# EAGLE schematic 11_16 Inverter PCB Schematic (EAGLE 7.7.0)
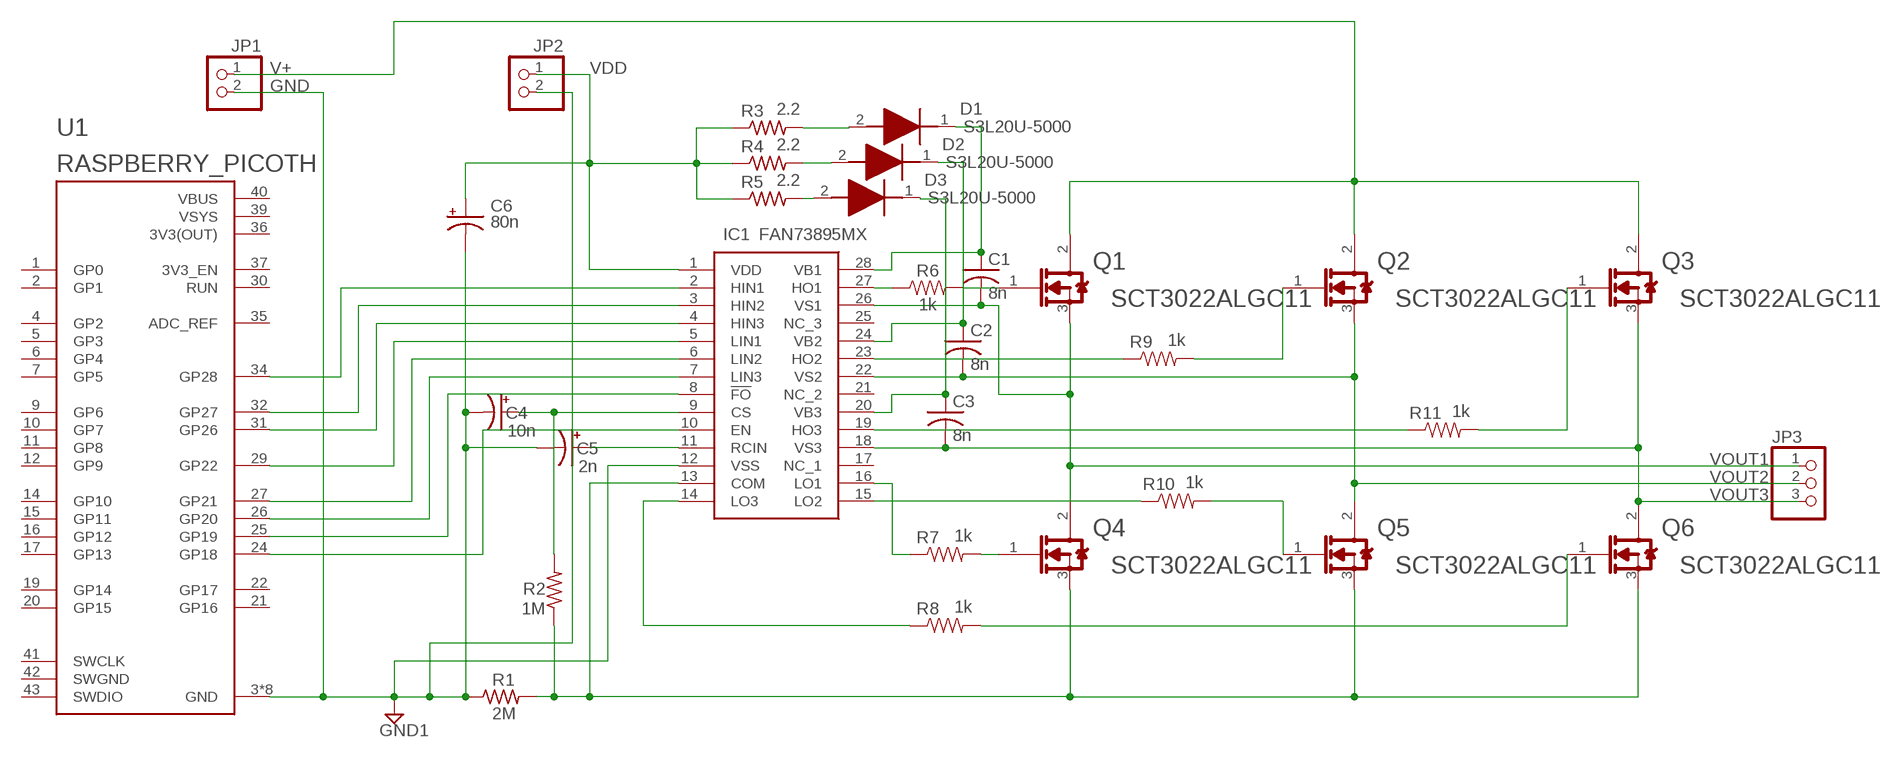
[diagram p0: schematic, sheet 1]

## Parts
C1  8n  C-US025-024X044  [C025-024X044]
C2  8n  C-US025-024X044  [C025-024X044]
C3  8n  C-US025-024X044  [C025-024X044]
C4  10n  CPOL-USSMCZ  [SMC_Z]
C5  2n  CPOL-USSMCZ  [SMC_Z]
C6  80n  CPOL-USSMCZ  [SMC_Z]
D1  S3L20U-5000  [DIOAD2460W140L700D440]
D2  S3L20U-5000  [DIOAD2460W140L700D440]
D3  S3L20U-5000  [DIOAD2460W140L700D440]
IC1  FAN73895MX  [SOIC127P1031X265-28N]
JP1  PINHD-1X2  [1X02]
JP2  PINHD-1X2  [1X02]
JP3  PINHD-1X3  [1X03]
Q1  ROHM_SCT3022ALGC11ROHM_SCT3022ALGC11_0_0  [ROHM_SCT3022ALGC11_0]
Q2  ROHM_SCT3022ALGC11ROHM_SCT3022ALGC11_0_0  [ROHM_SCT3022ALGC11_0]
Q3  ROHM_SCT3022ALGC11ROHM_SCT3022ALGC11_0_0  [ROHM_SCT3022ALGC11_0]
Q4  ROHM_SCT3022ALGC11ROHM_SCT3022ALGC11_0_0  [ROHM_SCT3022ALGC11_0]
Q5  ROHM_SCT3022ALGC11ROHM_SCT3022ALGC11_0_0  [ROHM_SCT3022ALGC11_0]
Q6  ROHM_SCT3022ALGC11ROHM_SCT3022ALGC11_0_0  [ROHM_SCT3022ALGC11_0]
R1  2M  R-US_0207/10  [0207/10]
R2  1M  R-US_0207/10  [0207/10]
R3  2.2  R-US_0207/10  [0207/10]
R4  2.2  R-US_0207/10  [0207/10]
R5  2.2  R-US_0207/10  [0207/10]
R6  1k  RESISTOR0603  [0603]
R7  1k  RESISTOR0603  [0603]
R8  1k  RESISTOR0603  [0603]
R9  1k  RESISTOR0603  [0603]
R10  1k  RESISTOR0603  [0603]
R11  1k  RESISTOR0603  [0603]
U1  RASPBERRY_PICOTH  [PICO-PKG-TH]

## Nets
GND: C4.- C5.- C6.- IC1.12(VSS) JP1.2 JP2.2 R1.1 U1.3(GND) U1.8(GND) U1.13(GND) U1.18(GND) U1.23(GND) U1.28(GND) U1.33(GND) U1.38(GND) ; supply symbol labelled GND1
N$1: IC1.2(HIN1) U1.34(GP28)
N$2: IC1.13(COM) Q4.3(SOURCE) Q5.3(SOURCE) Q6.3(SOURCE) R1.2 R2.1
N$3: IC1.19(HO3) R11.1
N$4: IC1.27(HO1) R6.1
N$5: IC1.8(!FO) U1.25(GP19)
N$6: Q1.1(GATE) R6.2
N$7: IC1.16(LO1) R7.1
N$8: Q5.1(GATE) R10.2
N$9: IC1.14(LO3) R8.1
N$10: Q3.1(GATE) R11.2
N$11: Q2.1(GATE) R9.2
N$12: IC1.10(EN) U1.24(GP18)
N$13: IC1.23(HO2) R9.1
N$14: Q6.1(GATE) R8.2
N$15: IC1.15(LO2) R10.1
N$16: Q4.1(GATE) R7.2
N$17: C1.1 D1.1(K) IC1.28(VB1)
N$18: C2.1 D2.1(K) IC1.24(VB2)
N$19: C3.1 D3.1(K) IC1.20(VB3)
N$20: IC1.3(HIN2) U1.32(GP27)
N$21: C5.+ IC1.11(RCIN)
N$22: IC1.4(HIN3) U1.31(GP26)
N$23: IC1.5(LIN1) U1.29(GP22)
N$24: IC1.6(LIN2) U1.27(GP21)
N$25: IC1.7(LIN3) U1.26(GP20)
N$26: D1.2(A) R3.2
N$27: C4.+ IC1.9(CS) R2.2
N$28: D2.2(A) R4.2
N$29: D3.2(A) R5.2
V+: JP1.1 Q1.2(DRAIN) Q2.2(DRAIN) Q3.2(DRAIN)
VDD: C6.+ IC1.1(VDD) JP2.1 R3.1 R4.1 R5.1
VOUT1: C1.2 IC1.26(VS1) JP3.1 Q1.3(SOURCE) Q4.2(DRAIN)
VOUT2: C2.2 IC1.22(VS2) JP3.2 Q2.3(SOURCE) Q5.2(DRAIN)
VOUT3: C3.2 IC1.18(VS3) JP3.3 Q3.3(SOURCE) Q6.2(DRAIN)
Unconnected: IC1.17(NC_1) IC1.21(NC_2) IC1.25(NC_3) U1.1(GP0) U1.2(GP1) U1.4(GP2) U1.5(GP3) U1.6(GP4) U1.7(GP5) U1.9(GP6) U1.10(GP7) U1.11(GP8) U1.12(GP9) U1.14(GP10) U1.15(GP11) U1.16(GP12) U1.17(GP13) U1.19(GP14) U1.20(GP15) U1.21(GP16) U1.22(GP17) U1.30(RUN) U1.35(ADC_REF) U1.37(3V3_EN) U1.41(SWCLK) U1.43(SWDIO)

## Power pins joined to a net without a drawn wire
3V3(OUT): U1.36(3V3(OUT))
SWGND: U1.42(SWGND)
VBUS: U1.40(VBUS)
VSYS: U1.39(VSYS)

## Library data of the parts
C1-C3 = rcl:C-US: CAPACITOR, American symbol; SPICEPREFIX: C
C4-C6 = rcl:CPOL-US: POLARIZED CAPACITOR, American symbol; SPICEPREFIX: C
D1-D3 = S3L20U-5000:S3L20U-5000: Diodes - General Purpose, Power, Switching Fast Recovery Diode Source: Datasheet <https://componentsearchengine.com/Datasheets/1/S3L20U-5000.pdf>; DESCRIPTION: Diodes - General Purpose, Power, Switching Fast Recovery Diode; HEIGHT: mm; MANUFACTURER_NAME: Shindengen; MANUFACTURER_PART_NUMBER: S3L20U-5000; MOUSER_PART_NUMBER: 627-S3L20U-5000; MOUSER_PRICE-STOCK: https://www.mouser.com/Search/Refine.aspx?Keyword=627-S3L20U-5000
IC1 = FAN73895MX:FAN73895MX: IC GATE DVR HALF BRDG 3PH 28SOIC Source: Datasheet <https://componentsearchengine.com/Datasheets/1/FAN73895MX.pdf>; DESCRIPTION: IC GATE DVR HALF BRDG 3PH 28SOIC; HEIGHT: 2.65mm; MANUFACTURER_NAME: onsemi; MANUFACTURER_PART_NUMBER: FAN73895MX; MOUSER_PART_NUMBER: 512-FAN73895MX; MOUSER_PRICE-STOCK: https://www.mouser.com/Search/Refine.aspx?Keyword=512-FAN73895MX
JP1 JP2 = pinhead:PINHD-1X2: PIN HEADER
JP3 = pinhead:PINHD-1X3: PIN HEADER
Q1-Q6 = ROHM - SCT3022ALGC11:ROHM_SCT3022ALGC11: MOSFET NCH 650V 93A TO247N; CENTROID_NOT_SPECIFIED: No; CONTINUOUS_DRAIN_CURRENT: 93A; DATASHEET: https://www.rohm.com/datasheet/SCT3022AL/sct3022al-e; DEVICE_CLASS_L1: Discrete Semiconductors; DEVICE_CLASS_L2: Transistors; DEVICE_CLASS_L3: MOSFETs; DIGIKEY_DESCRIPTION: TRANS MOSFET NCH 650V 93A TO247N; DIGIKEY_PART_NUMBER: SCT3022ALGC11-ND; DRAIN_TO_SOURCE_BREAKDOWN_VOLTAGE: 650V; DRAIN_TO_SOURCE_RESISTANCE: 22mΩ; DRAIN_TO_SOURCE_VOLTAGE: 650V; FOOTPRINT_URL: https://d1d2qsbl8m0m72.cloudfront.net/en/techdata_basic/power/dimension/SiC_TO-247N-e.pdf; GATE_TO_SOURCE_VOLTAGE: 22V; HEIGHT: 25.5mm; INPUT_CAPACITACE_AT_VDS: 2208pF @ 500V; LEAD_FREE: yes; MAX_JUNCTION_TEMP: +175°C; MF: ROHM; MFG_PACKAGE_IDENT: SCT3022ALGC11; MFG_PACKAGE_IDENT_DATE: 2/2017; MFG_PACKAGE_IDENT_REV: 001; MOUSER_DESCRIPTION: SCT3022AL Series 650 V 93 A 28.6 mOhm N-Channel SiC Power Mosfet - TO-247N; MOUSER_PART_NUMBER: 755-SCT3022ALGC11; MPN: SCT3022ALGC11; NUMBER_OF_CHANNELS: 1; NUMBER_OF_N_CHANNELS: 1; PACKAGE: TO247; POWER_DISSIPATION: 339W; PREFIX: Q; ROHS: yes; STANDOFF_HEIGHT: 3.8mm; TECHNOLOGY: MOSFET; TEMPERATURE_RANGE_HIGH: +175°C; THRESHOLD_VGS: 2.7V; TURN_OFF_DELAY_TIME: 61ns; TURN_ON_DELAY_TIME: 25ns; VERIFICATION_VERSION: 0.0.0.1
R1-R5 = rcl:R-US_: RESISTOR, American symbol; SPICEPREFIX: R
R6-R11 = SparkFun-Resistors:RESISTOR: Generic Resistor Package
U1 = RpiPico:RASPBERRY_PICO: Raspberry Pi Pico